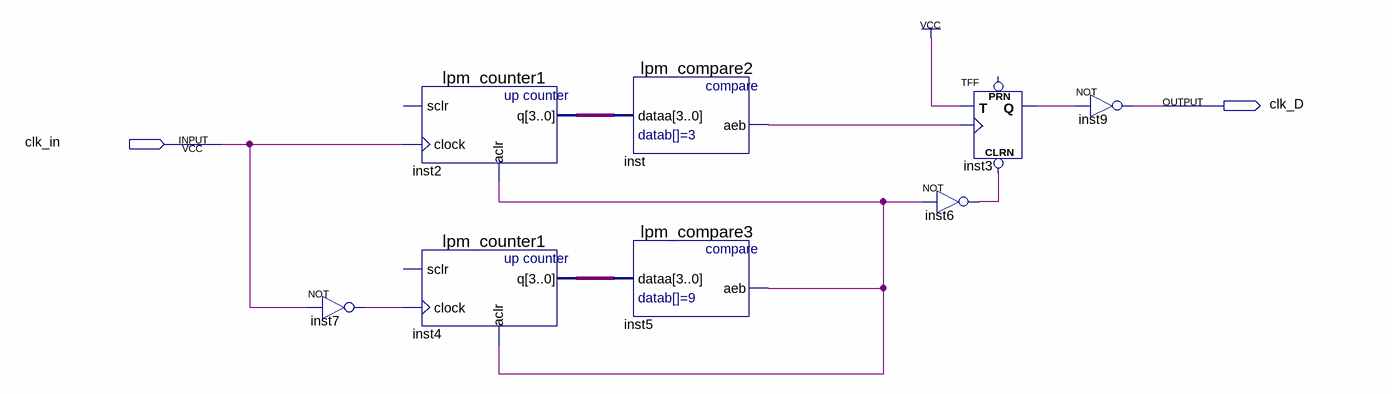
[diagram p0: schematic sheet]
// Quartus schematic Block2.bdf as structural Verilog: 8 symbols, 2 pins
module Block2 (
  input  clk_in,
  output clk_D
);

  wire inst3_q, inst5_aeb, inst6_out, inst7_out, inst_aeb;
  wire [3:0] inst2_q, inst4_q;

  not inst7 (inst7_out, clk_in);
  lpm_counter1 inst2 (.clock(clk_in), .aclr(inst5_aeb), .q(inst2_q));  // open: sclr
  lpm_counter1 inst4 (.clock(inst7_out), .aclr(inst5_aeb), .q(inst4_q));  // open: sclr
  lpm_compare2 inst (.dataa(inst2_q), .aeb(inst_aeb));
  lpm_compare3 inst5 (.dataa(inst4_q), .aeb(inst5_aeb));
  TFF inst3 (.CLRN(inst6_out), .T(1'b1), .CLK(inst_aeb), .Q(inst3_q));  // open: PRN
  not inst6 (inst6_out, inst5_aeb);
  not inst9 (clk_D, inst3_q);
endmodule
